# Altium schematic sheet VALVEBOARD_ValveDrive1.SchDoc
size A3; SheetNumber: 4; SheetTotal: 7
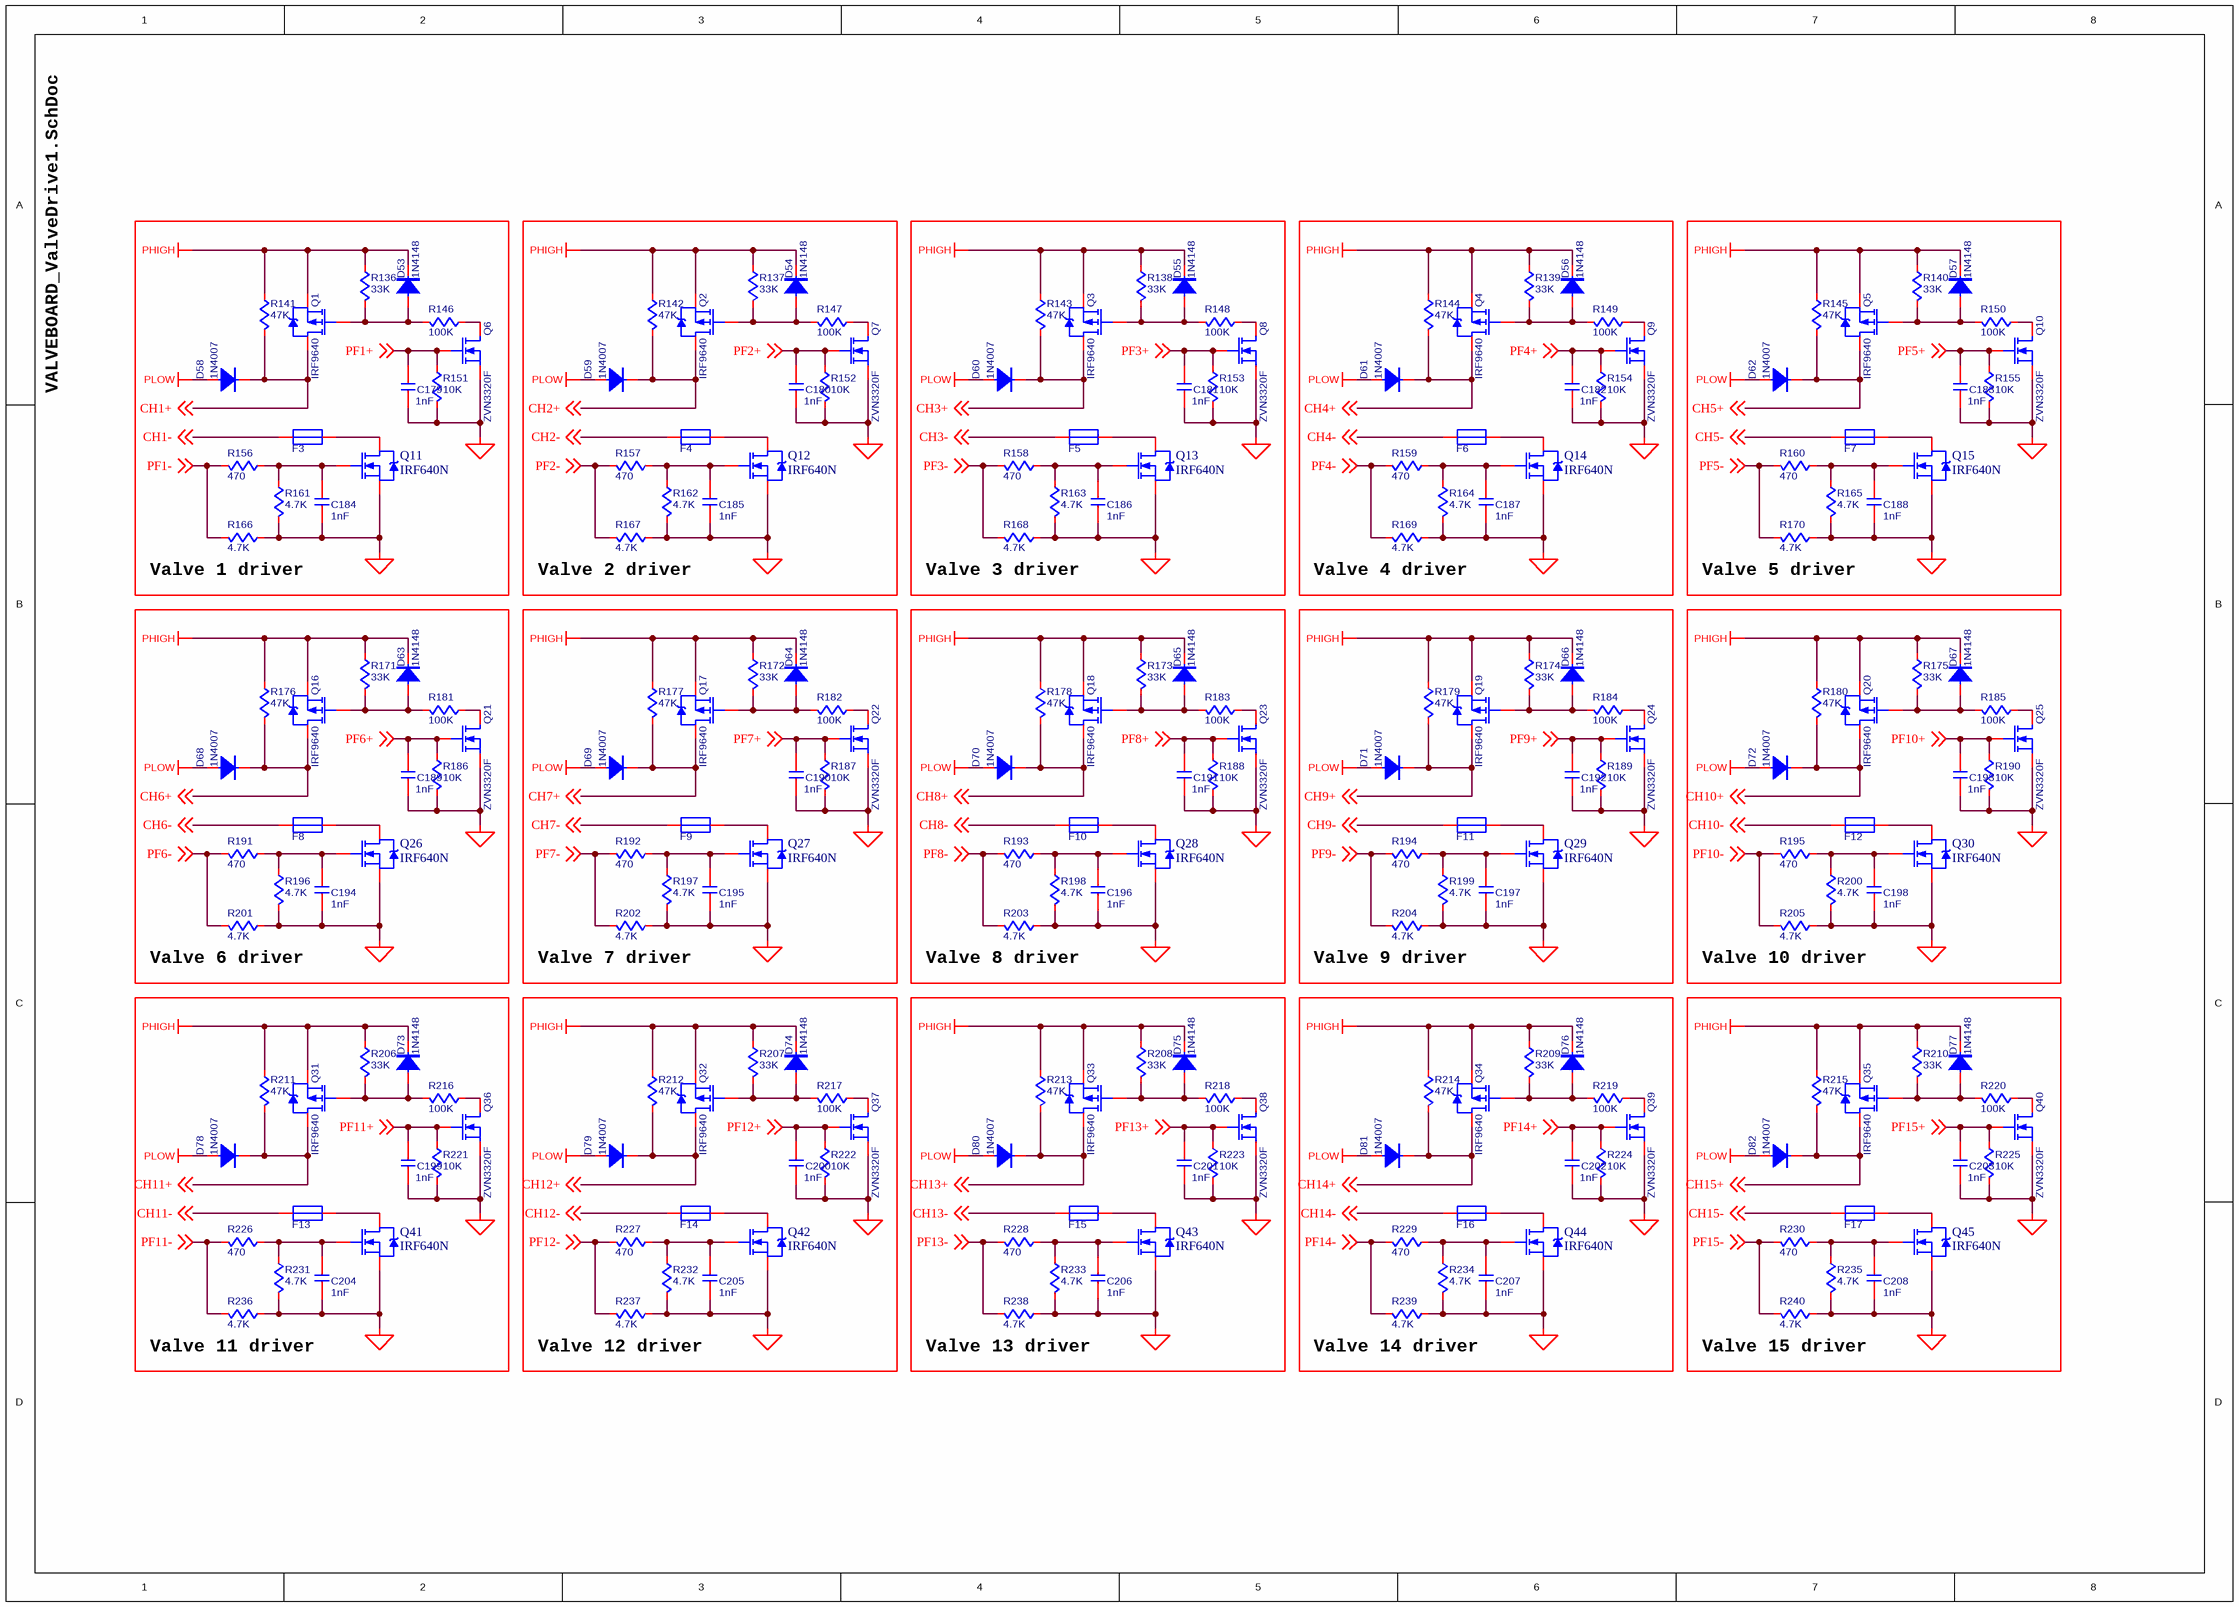
[diagram p0: VALVEBOARD_ValveDrive1.SchDoc]

## Parts
C179  value 1nF  [C0603]  (hidden comment: C-NOMO)
C180  value 1nF  [C0603]  (hidden comment: C-NOMO)
C181  value 1nF  [C0603]  (hidden comment: C-NOMO)
C182  value 1nF  [C0603]  (hidden comment: C-NOMO)
C183  value 1nF  [C0603]  (hidden comment: C-NOMO)
C184  value 1nF  [C0603]  (hidden comment: C-NOMO)
C185  value 1nF  [C0603]  (hidden comment: C-NOMO)
C186  value 1nF  [C0603]  (hidden comment: C-NOMO)
C187  value 1nF  [C0603]  (hidden comment: C-NOMO)
C188  value 1nF  [C0603]  (hidden comment: C-NOMO)
C189  value 1nF  [C0603]  (hidden comment: C-NOMO)
C190  value 1nF  [C0603]  (hidden comment: C-NOMO)
C191  value 1nF  [C0603]  (hidden comment: C-NOMO)
C192  value 1nF  [C0603]  (hidden comment: C-NOMO)
C193  value 1nF  [C0603]  (hidden comment: C-NOMO)
C194  value 1nF  [C0603]  (hidden comment: C-NOMO)
C195  value 1nF  [C0603]  (hidden comment: C-NOMO)
C196  value 1nF  [C0603]  (hidden comment: C-NOMO)
C197  value 1nF  [C0603]  (hidden comment: C-NOMO)
C198  value 1nF  [C0603]  (hidden comment: C-NOMO)
C199  value 1nF  [C0603]  (hidden comment: C-NOMO)
C200  value 1nF  [C0603]  (hidden comment: C-NOMO)
C201  value 1nF  [C0603]  (hidden comment: C-NOMO)
C202  value 1nF  [C0603]  (hidden comment: C-NOMO)
C203  value 1nF  [C0603]  (hidden comment: C-NOMO)
C204  value 1nF  [C0603]  (hidden comment: C-NOMO)
C205  value 1nF  [C0603]  (hidden comment: C-NOMO)
C206  value 1nF  [C0603]  (hidden comment: C-NOMO)
C207  value 1nF  [C0603]  (hidden comment: C-NOMO)
C208  value 1nF  [C0603]  (hidden comment: C-NOMO)
D53  1N4148  [sod-123]
D54  1N4148  [sod-123]
D55  1N4148  [sod-123]
D56  1N4148  [sod-123]
D57  1N4148  [sod-123]
D58  1N4007  [1N4148]
D59  1N4007  [1N4148]
D60  1N4007  [1N4148]
D61  1N4007  [1N4148]
D62  1N4007  [1N4148]
D63  1N4148  [sod-123]
D64  1N4148  [sod-123]
D65  1N4148  [sod-123]
D66  1N4148  [sod-123]
D67  1N4148  [sod-123]
D68  1N4007  [1N4148]
D69  1N4007  [1N4148]
D70  1N4007  [1N4148]
D71  1N4007  [1N4148]
D72  1N4007  [1N4148]
D73  1N4148  [sod-123]
D74  1N4148  [sod-123]
D75  1N4148  [sod-123]
D76  1N4148  [sod-123]
D77  1N4148  [sod-123]
D78  1N4007  [1N4148]
D79  1N4007  [1N4148]
D80  1N4007  [1N4148]
D81  1N4007  [1N4148]
D82  1N4007  [1N4148]
F3  F50  [F-TH]  (value not drawn)
F4  F50  [F-TH]  (value not drawn)
F5  F50  [F-TH]  (value not drawn)
F6  F50  [F-TH]  (value not drawn)
F7  F50  [F-TH]  (value not drawn)
F8  F50  [F-TH]  (value not drawn)
F9  F50  [F-TH]  (value not drawn)
F10  F50  [F-TH]  (value not drawn)
F11  F50  [F-TH]  (value not drawn)
F12  F50  [F-TH]  (value not drawn)
F13  F50  [F-TH]  (value not drawn)
F14  F50  [F-TH]  (value not drawn)
F15  F50  [F-TH]  (value not drawn)
F16  F50  [F-TH]  (value not drawn)
F17  F50  [F-TH]  (value not drawn)
Q1  IRF9640  [TO-220AB]
Q2  IRF9640  [TO-220AB]
Q3  IRF9640  [TO-220AB]
Q4  IRF9640  [TO-220AB]
Q5  IRF9640  [TO-220AB]
Q6  ZVN3320F  [ZVN3320F]
Q7  ZVN3320F  [ZVN3320F]
Q8  ZVN3320F  [ZVN3320F]
Q9  ZVN3320F  [ZVN3320F]
Q10  ZVN3320F  [ZVN3320F]
Q11  IRF640N  [TO-220AB]
Q12  IRF640N  [TO-220AB]
Q13  IRF640N  [TO-220AB]
Q14  IRF640N  [TO-220AB]
Q15  IRF640N  [TO-220AB]
Q16  IRF9640  [TO-220AB]
Q17  IRF9640  [TO-220AB]
Q18  IRF9640  [TO-220AB]
Q19  IRF9640  [TO-220AB]
Q20  IRF9640  [TO-220AB]
Q21  ZVN3320F  [ZVN3320F]
Q22  ZVN3320F  [ZVN3320F]
Q23  ZVN3320F  [ZVN3320F]
Q24  ZVN3320F  [ZVN3320F]
Q25  ZVN3320F  [ZVN3320F]
Q26  IRF640N  [TO-220AB]
Q27  IRF640N  [TO-220AB]
Q28  IRF640N  [TO-220AB]
Q29  IRF640N  [TO-220AB]
Q30  IRF640N  [TO-220AB]
Q31  IRF9640  [TO-220AB]
Q32  IRF9640  [TO-220AB]
Q33  IRF9640  [TO-220AB]
Q34  IRF9640  [TO-220AB]
Q35  IRF9640  [TO-220AB]
Q36  ZVN3320F  [ZVN3320F]
Q37  ZVN3320F  [ZVN3320F]
Q38  ZVN3320F  [ZVN3320F]
Q39  ZVN3320F  [ZVN3320F]
Q40  ZVN3320F  [ZVN3320F]
Q41  IRF640N  [TO-220AB]
Q42  IRF640N  [TO-220AB]
Q43  IRF640N  [TO-220AB]
Q44  IRF640N  [TO-220AB]
Q45  IRF640N  [TO-220AB]
R136  value 33K  [R0603]  (hidden comment: R)
R137  value 33K  [R0603]  (hidden comment: R)
R138  value 33K  [R0603]  (hidden comment: R)
R139  value 33K  [R0603]  (hidden comment: R)
R140  value 33K  [R0603]  (hidden comment: R)
R141  value 47K  [R2512]  (hidden comment: R)
R142  value 47K  [R2512]  (hidden comment: R)
R143  value 47K  [R2512]  (hidden comment: R)
R144  value 47K  [R2512]  (hidden comment: R)
R145  value 47K  [R2512]  (hidden comment: R)
R146  value 100K  [R0603]  (hidden comment: R)
R147  value 100K  [R0603]  (hidden comment: R)
R148  value 100K  [R0603]  (hidden comment: R)
R149  value 100K  [R0603]  (hidden comment: R)
R150  value 100K  [R0603]  (hidden comment: R)
R151  value 10K  [R0603]  (hidden comment: R)
R152  value 10K  [R0603]  (hidden comment: R)
R153  value 10K  [R0603]  (hidden comment: R)
R154  value 10K  [R0603]  (hidden comment: R)
R155  value 10K  [R0603]  (hidden comment: R)
R156  value 470  [R0402]  (hidden comment: R)
R157  value 470  [R0402]  (hidden comment: R)
R158  value 470  [R0402]  (hidden comment: R)
R159  value 470  [R0402]  (hidden comment: R)
R160  value 470  [R0402]  (hidden comment: R)
R161  value 4.7K  [R0402]  (hidden comment: R)
R162  value 4.7K  [R0402]  (hidden comment: R)
R163  value 4.7K  [R0402]  (hidden comment: R)
R164  value 4.7K  [R0402]  (hidden comment: R)
R165  value 4.7K  [R0402]  (hidden comment: R)
R166  value 4.7K  [R0402]  (hidden comment: R)
R167  value 4.7K  [R0402]  (hidden comment: R)
R168  value 4.7K  [R0402]  (hidden comment: R)
R169  value 4.7K  [R0402]  (hidden comment: R)
R170  value 4.7K  [R0402]  (hidden comment: R)
R171  value 33K  [R0603]  (hidden comment: R)
R172  value 33K  [R0603]  (hidden comment: R)
R173  value 33K  [R0603]  (hidden comment: R)
R174  value 33K  [R0603]  (hidden comment: R)
R175  value 33K  [R0603]  (hidden comment: R)
R176  value 47K  [R2512]  (hidden comment: R)
R177  value 47K  [R2512]  (hidden comment: R)
R178  value 47K  [R2512]  (hidden comment: R)
R179  value 47K  [R2512]  (hidden comment: R)
R180  value 47K  [R2512]  (hidden comment: R)
R181  value 100K  [R0603]  (hidden comment: R)
R182  value 100K  [R0603]  (hidden comment: R)
R183  value 100K  [R0603]  (hidden comment: R)
R184  value 100K  [R0603]  (hidden comment: R)
R185  value 100K  [R0603]  (hidden comment: R)
R186  value 10K  [R0603]  (hidden comment: R)
R187  value 10K  [R0603]  (hidden comment: R)
R188  value 10K  [R0603]  (hidden comment: R)
R189  value 10K  [R0603]  (hidden comment: R)
R190  value 10K  [R0603]  (hidden comment: R)
R191  value 470  [R0402]  (hidden comment: R)
R192  value 470  [R0402]  (hidden comment: R)
R193  value 470  [R0402]  (hidden comment: R)
R194  value 470  [R0402]  (hidden comment: R)
R195  value 470  [R0402]  (hidden comment: R)
R196  value 4.7K  [R0402]  (hidden comment: R)
R197  value 4.7K  [R0402]  (hidden comment: R)
R198  value 4.7K  [R0402]  (hidden comment: R)
R199  value 4.7K  [R0402]  (hidden comment: R)
R200  value 4.7K  [R0402]  (hidden comment: R)
R201  value 4.7K  [R0402]  (hidden comment: R)
R202  value 4.7K  [R0402]  (hidden comment: R)
R203  value 4.7K  [R0402]  (hidden comment: R)
R204  value 4.7K  [R0402]  (hidden comment: R)
R205  value 4.7K  [R0402]  (hidden comment: R)
R206  value 33K  [R0603]  (hidden comment: R)
R207  value 33K  [R0603]  (hidden comment: R)
R208  value 33K  [R0603]  (hidden comment: R)
R209  value 33K  [R0603]  (hidden comment: R)
R210  value 33K  [R0603]  (hidden comment: R)
R211  value 47K  [R2512]  (hidden comment: R)
R212  value 47K  [R2512]  (hidden comment: R)
R213  value 47K  [R2512]  (hidden comment: R)
R214  value 47K  [R2512]  (hidden comment: R)
R215  value 47K  [R2512]  (hidden comment: R)
R216  value 100K  [R0603]  (hidden comment: R)
R217  value 100K  [R0603]  (hidden comment: R)
R218  value 100K  [R0603]  (hidden comment: R)
R219  value 100K  [R0603]  (hidden comment: R)
R220  value 100K  [R0603]  (hidden comment: R)
R221  value 10K  [R0603]  (hidden comment: R)
R222  value 10K  [R0603]  (hidden comment: R)
R223  value 10K  [R0603]  (hidden comment: R)
R224  value 10K  [R0603]  (hidden comment: R)
R225  value 10K  [R0603]  (hidden comment: R)
R226  value 470  [R0402]  (hidden comment: R)
R227  value 470  [R0402]  (hidden comment: R)
R228  value 470  [R0402]  (hidden comment: R)
R229  value 470  [R0402]  (hidden comment: R)
R230  value 470  [R0402]  (hidden comment: R)
R231  value 4.7K  [R0402]  (hidden comment: R)
R232  value 4.7K  [R0402]  (hidden comment: R)
R233  value 4.7K  [R0402]  (hidden comment: R)
R234  value 4.7K  [R0402]  (hidden comment: R)
R235  value 4.7K  [R0402]  (hidden comment: R)
R236  value 4.7K  [R0402]  (hidden comment: R)
R237  value 4.7K  [R0402]  (hidden comment: R)
R238  value 4.7K  [R0402]  (hidden comment: R)
R239  value 4.7K  [R0402]  (hidden comment: R)
R240  value 4.7K  [R0402]  (hidden comment: R)

## Blocks framed on the sheet
Valve 1 driver: C179 C184 D53 D58 F3 Q1 Q6 Q11 R136 R141 R146 R151 R156 R161 R166
Valve 2 driver: C180 C185 D54 D59 F4 Q2 Q7 Q12 R137 R142 R147 R152 R157 R162 R167
Valve 3 driver: C181 C186 D55 D60 F5 Q3 Q8 Q13 R138 R143 R148 R153 R158 R163 R168
Valve 4 driver: C182 C187 D56 D61 F6 Q4 Q9 Q14 R139 R144 R149 R154 R159 R164 R169
Valve 5 driver: C183 C188 D57 D62 F7 Q5 Q10 Q15 R140 R145 R150 R155 R160 R165 R170
Valve 6 driver: C189 C194 D63 D68 F8 Q16 Q21 Q26 R171 R176 R181 R186 R191 R196 R201
Valve 7 driver: C190 C195 D64 D69 F9 Q17 Q22 Q27 R172 R177 R182 R187 R192 R197 R202
Valve 8 driver: C191 C196 D65 D70 F10 Q18 Q23 Q28 R173 R178 R183 R188 R193 R198 R203
Valve 9 driver: C192 C197 D66 D71 F11 Q19 Q24 Q29 R174 R179 R184 R189 R194 R199 R204
Valve 10 driver: C193 C198 D67 D72 F12 Q20 Q25 Q30 R175 R180 R185 R190 R195 R200 R205
Valve 11 driver: C199 C204 D73 D78 F13 Q31 Q36 Q41 R206 R211 R216 R221 R226 R231 R236
Valve 12 driver: C200 C205 D74 D79 F14 Q32 Q37 Q42 R207 R212 R217 R222 R227 R232 R237
Valve 13 driver: C201 C206 D75 D80 F15 Q33 Q38 Q43 R208 R213 R218 R223 R228 R233 R238
Valve 14 driver: C202 C207 D76 D81 F16 Q34 Q39 Q44 R209 R214 R219 R224 R229 R234 R239
Valve 15 driver: C203 C208 D77 D82 F17 Q35 Q40 Q45 R210 R215 R220 R225 R230 R235 R240

## Nets
PGND: C179.1 C180.1 C181.1 C182.1 C183.1 C184.1 C185.1 C186.1 C187.1 C188.1 C189.1 C190.1 C191.1 C192.1 C193.1 C194.1 C195.1 C196.1 C197.1 C198.1 C199.1 C200.1 C201.1 C202.1 C203.1 C204.1 C205.1 C206.1 C207.1 C208.1 Q6.3(S) Q7.3(S) Q8.3(S) Q9.3(S) Q10.3(S) Q11.3(S) Q12.3(S) Q13.3(S) Q14.3(S) Q15.3(S) Q21.3(S) Q22.3(S) Q23.3(S) Q24.3(S) Q25.3(S) Q26.3(S) Q27.3(S) Q28.3(S) Q29.3(S) Q30.3(S) Q36.3(S) Q37.3(S) Q38.3(S) Q39.3(S) Q40.3(S) Q41.3(S) Q42.3(S) Q43.3(S) Q44.3(S) Q45.3(S) R151.1 R152.1 R153.1 R154.1 R155.1 R161.1 R162.1 R163.1 R164.1 R165.1 R166.2 R167.2 R168.2 R169.2 R170.2 R186.1 R187.1 R188.1 R189.1 R190.1 R196.1 R197.1 R198.1 R199.1 R200.1 R201.2 R202.2 R203.2 R204.2 R205.2 R221.1 R222.1 R223.1 R224.1 R225.1 R231.1 R232.1 R233.1 R234.1 R235.1 R236.2 R237.2 R238.2 R239.2 R240.2
PHIGH: D53.1 D54.1 D55.1 D56.1 D57.1 D63.1 D64.1 D65.1 D66.1 D67.1 D73.1 D74.1 D75.1 D76.1 D77.1 Q1.3(S) Q2.3(S) Q3.3(S) Q4.3(S) Q5.3(S) Q16.3(S) Q17.3(S) Q18.3(S) Q19.3(S) Q20.3(S) Q31.3(S) Q32.3(S) Q33.3(S) Q34.3(S) Q35.3(S) R136.2 R137.2 R138.2 R139.2 R140.2 R141.2 R142.2 R143.2 R144.2 R145.2 R171.2 R172.2 R173.2 R174.2 R175.2 R176.2 R177.2 R178.2 R179.2 R180.2 R206.2 R207.2 R208.2 R209.2 R210.2 R211.2 R212.2 R213.2 R214.2 R215.2
PLOW: D58.2 D59.2 D60.2 D61.2 D62.2 D68.2 D69.2 D70.2 D71.2 D72.2 D78.2 D79.2 D80.2 D81.2 D82.2
CH1+: D58.1 Q1.2(D) R141.1 ; off-sheet CH1+
CH1-: F3.1 ; off-sheet CH1-
CH2+: D59.1 Q2.2(D) R142.1 ; off-sheet CH2+
CH2-: F4.1 ; off-sheet CH2-
CH3+: D60.1 Q3.2(D) R143.1 ; off-sheet CH3+
CH3-: F5.1 ; off-sheet CH3-
CH4+: D61.1 Q4.2(D) R144.1 ; off-sheet CH4+
CH4-: F6.1 ; off-sheet CH4-
CH5+: D62.1 Q5.2(D) R145.1 ; off-sheet CH5+
CH5-: F7.1 ; off-sheet CH5-
CH6+: D68.1 Q16.2(D) R176.1 ; off-sheet CH6+
CH6-: F8.1 ; off-sheet CH6-
CH7+: D69.1 Q17.2(D) R177.1 ; off-sheet CH7+
CH7-: F9.1 ; off-sheet CH7-
CH8+: D70.1 Q18.2(D) R178.1 ; off-sheet CH8+
CH8-: F10.1 ; off-sheet CH8-
CH9+: D71.1 Q19.2(D) R179.1 ; off-sheet CH9+
CH9-: F11.1 ; off-sheet CH9-
CH10+: D72.1 Q20.2(D) R180.1 ; off-sheet CH10+
CH10-: F12.1 ; off-sheet CH10-
CH11+: D78.1 Q31.2(D) R211.1 ; off-sheet CH11+
CH11-: F13.1 ; off-sheet CH11-
CH12+: D79.1 Q32.2(D) R212.1 ; off-sheet CH12+
CH12-: F14.1 ; off-sheet CH12-
CH13+: D80.1 Q33.2(D) R213.1 ; off-sheet CH13+
CH13-: F15.1 ; off-sheet CH13-
CH14+: D81.1 Q34.2(D) R214.1 ; off-sheet CH14+
CH14-: F16.1 ; off-sheet CH14-
CH15+: D82.1 Q35.2(D) R215.1 ; off-sheet CH15+
CH15-: F17.1 ; off-sheet CH15-
PF1+: C179.2 Q6.2(G) R151.2 ; off-sheet PF1+
PF1-: R156.1 R166.1 ; off-sheet PF1-
PF2+: C180.2 Q7.2(G) R152.2 ; off-sheet PF2+
PF2-: R157.1 R167.1 ; off-sheet PF2-
PF3+: C181.2 Q8.2(G) R153.2 ; off-sheet PF3+
PF3-: R158.1 R168.1 ; off-sheet PF3-
PF4+: C182.2 Q9.2(G) R154.2 ; off-sheet PF4+
PF4-: R159.1 R169.1 ; off-sheet PF4-
PF5+: C183.2 Q10.2(G) R155.2 ; off-sheet PF5+
PF5-: R160.1 R170.1 ; off-sheet PF5-
PF6+: C189.2 Q21.2(G) R186.2 ; off-sheet PF6+
PF6-: R191.1 R201.1 ; off-sheet PF6-
PF7+: C190.2 Q22.2(G) R187.2 ; off-sheet PF7+
PF7-: R192.1 R202.1 ; off-sheet PF7-
PF8+: C191.2 Q23.2(G) R188.2 ; off-sheet PF8+
PF8-: R193.1 R203.1 ; off-sheet PF8-
PF9+: C192.2 Q24.2(G) R189.2 ; off-sheet PF9+
PF9-: R194.1 R204.1 ; off-sheet PF9-
PF10+: C193.2 Q25.2(G) R190.2 ; off-sheet PF10+
PF10-: R195.1 R205.1 ; off-sheet PF10-
PF11+: C199.2 Q36.2(G) R221.2 ; off-sheet PF11+
PF11-: R226.1 R236.1 ; off-sheet PF11-
PF12+: C200.2 Q37.2(G) R222.2 ; off-sheet PF12+
PF12-: R227.1 R237.1 ; off-sheet PF12-
PF13+: C201.2 Q38.2(G) R223.2 ; off-sheet PF13+
PF13-: R228.1 R238.1 ; off-sheet PF13-
PF14+: C202.2 Q39.2(G) R224.2 ; off-sheet PF14+
PF14-: R229.1 R239.1 ; off-sheet PF14-
PF15+: C203.2 Q40.2(G) R225.2 ; off-sheet PF15+
PF15-: R230.1 R240.1 ; off-sheet PF15-
NetC184_2: C184.2 Q11.1(G) R156.2 R161.2
NetC185_2: C185.2 Q12.1(G) R157.2 R162.2
NetC186_2: C186.2 Q13.1(G) R158.2 R163.2
NetC187_2: C187.2 Q14.1(G) R159.2 R164.2
NetC188_2: C188.2 Q15.1(G) R160.2 R165.2
NetC194_2: C194.2 Q26.1(G) R191.2 R196.2
NetC195_2: C195.2 Q27.1(G) R192.2 R197.2
NetC196_2: C196.2 Q28.1(G) R193.2 R198.2
NetC197_2: C197.2 Q29.1(G) R194.2 R199.2
NetC198_2: C198.2 Q30.1(G) R195.2 R200.2
NetC204_2: C204.2 Q41.1(G) R226.2 R231.2
NetC205_2: C205.2 Q42.1(G) R227.2 R232.2
NetC206_2: C206.2 Q43.1(G) R228.2 R233.2
NetC207_2: C207.2 Q44.1(G) R229.2 R234.2
NetC208_2: C208.2 Q45.1(G) R230.2 R235.2
NetD53_2: D53.2 Q1.1(G) R136.1 R146.1
NetD54_2: D54.2 Q2.1(G) R137.1 R147.1
NetD55_2: D55.2 Q3.1(G) R138.1 R148.1
NetD56_2: D56.2 Q4.1(G) R139.1 R149.1
NetD57_2: D57.2 Q5.1(G) R140.1 R150.1
NetD63_2: D63.2 Q16.1(G) R171.1 R181.1
NetD64_2: D64.2 Q17.1(G) R172.1 R182.1
NetD65_2: D65.2 Q18.1(G) R173.1 R183.1
NetD66_2: D66.2 Q19.1(G) R174.1 R184.1
NetD67_2: D67.2 Q20.1(G) R175.1 R185.1
NetD73_2: D73.2 Q31.1(G) R206.1 R216.1
NetD74_2: D74.2 Q32.1(G) R207.1 R217.1
NetD75_2: D75.2 Q33.1(G) R208.1 R218.1
NetD76_2: D76.2 Q34.1(G) R209.1 R219.1
NetD77_2: D77.2 Q35.1(G) R210.1 R220.1
NetF3_2: F3.2 Q11.2(D)
NetF4_2: F4.2 Q12.2(D)
NetF5_2: F5.2 Q13.2(D)
NetF6_2: F6.2 Q14.2(D)
NetF7_2: F7.2 Q15.2(D)
NetF8_2: F8.2 Q26.2(D)
NetF9_2: F9.2 Q27.2(D)
NetF10_2: F10.2 Q28.2(D)
NetF11_2: F11.2 Q29.2(D)
NetF12_2: F12.2 Q30.2(D)
NetF13_2: F13.2 Q41.2(D)
NetF14_2: F14.2 Q42.2(D)
NetF15_2: F15.2 Q43.2(D)
NetF16_2: F16.2 Q44.2(D)
NetF17_2: F17.2 Q45.2(D)
NetQ6_1: Q6.1(D) R146.2
NetQ7_1: Q7.1(D) R147.2
NetQ8_1: Q8.1(D) R148.2
NetQ9_1: Q9.1(D) R149.2
NetQ10_1: Q10.1(D) R150.2
NetQ21_1: Q21.1(D) R181.2
NetQ22_1: Q22.1(D) R182.2
NetQ23_1: Q23.1(D) R183.2
NetQ24_1: Q24.1(D) R184.2
NetQ25_1: Q25.1(D) R185.2
NetQ36_1: Q36.1(D) R216.2
NetQ37_1: Q37.1(D) R217.2
NetQ38_1: Q38.1(D) R218.2
NetQ39_1: Q39.1(D) R219.2
NetQ40_1: Q40.1(D) R220.2

## Library data of the parts
C179-C208 = C-NOMO: voltage: 25V; precision: 5%
D53-D82 = DIOD1
Q1-Q5 Q16-Q20 Q31-Q35 = IRF9640: P-Channel Power MOSFET; Note: Pin 4 not drawn and electrically connected to Pin 2.; Published: 8-Jun-2000; LatestRevisionDate: 17-Jul-2002; LatestRevisionNote: Re-released for DXP Platform.; DatasheetVersion: PD-9.390D; PackageVersion: Feb-1997; PackageReference: TO-220AB; Publisher: Altium Limited; PackageDescription: TO, Thru-Hole, Vertical, Heatsink Mounted; 3 In-Line Leads; Pitch 2.54 mm; ComponentLink1Description: Manufacturer Link; ComponentLink1URL: http://www.irf.com/
Q6-Q10 Q21-Q25 Q36-Q40 = ZVN3320F: N-Channel MOSFET; Published: 8-Jun-2000; LatestRevisionDate: 17-Jul-2002; LatestRevisionNote: Re-released for DXP Platform.; PackageVersion: 1995/1996; PackageReference: E3; Publisher: Altium Limited; PackageDescription: TO, Flat Index; 3 In-Line, Axial Leads; Body Dia. 4.6mm; Lead Dia. 0.5 mm (max)
Q11-Q15 Q26-Q30 Q41-Q45 = IRF640N: N-Channel Power MOSFET; Note: Pin 2 is electrically connected to pin 4.; Published: 8-Jun-2000; LatestRevisionDate: 17-Jul-2002; LatestRevisionNote: Re-released for DXP Platform.; DatasheetVersion: PD-9.814; PackageVersion: Feb-1997; PackageReference: TO-220AB; Publisher: Altium Limited; PackageDescription: TO, Thru-Hole, Vertical, Heatsink Mounted; 3 In-Line Leads; Pitch 2.54 mm; ComponentLink1Description: Manufacturer Link; ComponentLink1URL: http://www.irf.com/
R136-R240 = R: precision: 1%